# Altium schematic sheet chanel.SchDoc
size A4
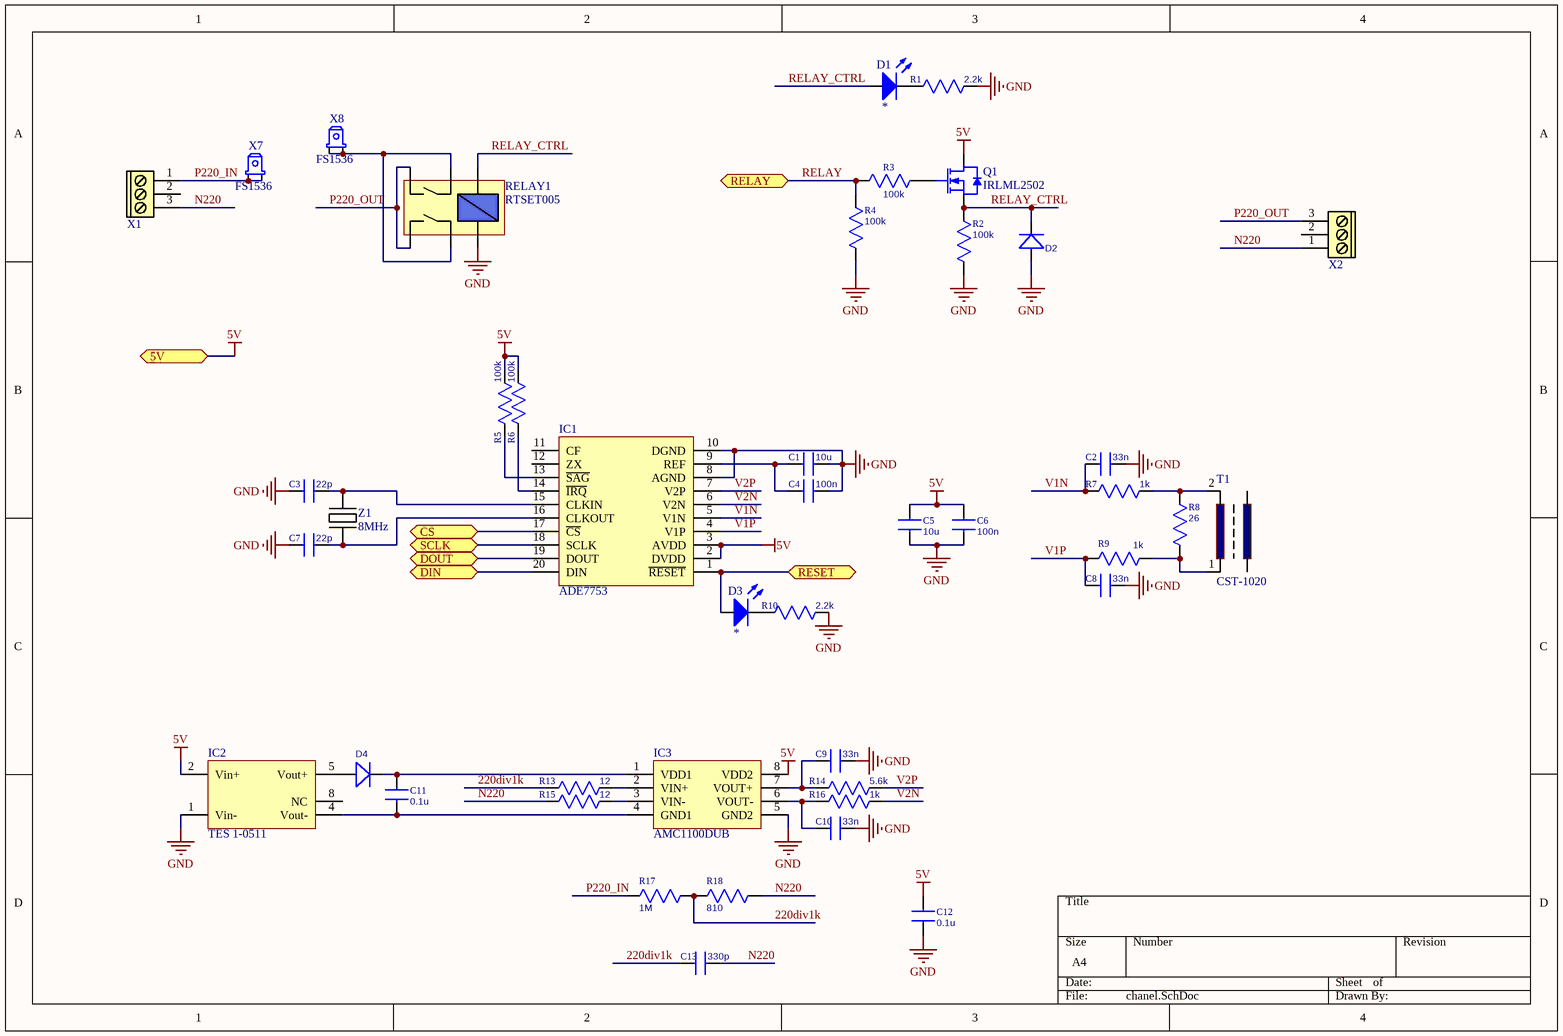
[diagram p0: chanel.SchDoc]

## Parts
C1  10u  [C_0805]
C2  33n  [C_0603]
C3  22p  [C_0603]
C4  100n  [C_0603]
C5  10u  [C_0805]
C6  100n  [C_0603]
C7  22p  [C_0603]
C8  33n  [C_0603]
C9  33n  [C_0603]
C10  33n  [C_0603]
C11  0.1u  [C_0603]
C12  0.1u  [C_0603]
C13  330p  [C_0603]
D1  *  [LED_5mm]
D2  D_DO-214AC  [DO-214AC]  (value not drawn)
D3  *  [LED_5mm]
D4  D_DO-214AC  [DO-214AC]  (value not drawn)
IC1  ADE7753  [SOP-20]
IC2  TES 1-0511  [TES 1-0511]
IC3  AMC1100DUB  [SOP254-8N]
Q1  IRLML2502  [SOT23]
R1  2.2k  [R_0603]
R2  100k  [R_0603]
R3  100k  [R_0603]
R4  100k  [R_0603]
R5  100k  [R_0603]
R6  100k  [R_0603]
R7  1k  [R_0603]
R8  26  [R_0805]
R9  1k  [R_0603]
R10  2.2k  [R_0603]
R13  12  [R_0603]
R14  5.6k  [R_0603]
R15  12  [R_0603]
R16  1k  [R_0603]
R17  1M  [R_0805]
R18  810  [R_0805]
RELAY1  RTSET005  [RTSET005]
T1  CST-1020  [CST-1020]
X1  DG-300-3  [DG-300-5MM-3]  (value not drawn)
X2  DG-300-3  [DG-300-5MM-3]  (value not drawn)
X7  FS1536  [FS1536]
X8  FS1536  [FS1536]
Z1  8MHz  [HC-49]

## Ports
5V, CS, DIN, DOUT, RELAY, RESET, SCLK

## Nets
5V: C5.2 C6.2 C12.2 IC1.2(DVDD) IC1.3(AVDD) IC2.2(Vin+) IC3.8(VDD2) Q1.3(D) R5.2 R6.2 ; port 5V
GND: C1.2 C2.2 C3.1 C4.2 C5.1 C6.1 C7.1 C8.2 C9.2 C10.2 C12.1 D2.1(A) IC1.8(AGND) IC1.10(DGND) IC2.1(Vin-) IC3.5(GND2) R1.2 R2.2 R4.2 R10.2 RELAY1.6
220div1k: C13.1 R13.1 R17.2 R18.1
CS: IC1.17(~{CS}) ; port CS
DIN: IC1.20(DIN) ; port DIN
DOUT: IC1.19(DOUT) ; port DOUT
N220: C13.2 R15.1 R18.2 X1.3 X2.1
P220_IN: R17.1 X1.1 X7.1
P220_OUT: RELAY1.1 RELAY1.2 X2.3
RELAY: R3.2 R4.1 ; port RELAY
RELAY_CTRL: D1.1(A) D2.2(K) Q1.2(S) R2.1 RELAY1.5
RESET: D3.1(A) IC1.1(~{RESET}) ; port RESET
SCLK: IC1.18(SCLK) ; port SCLK
V1N: C2.1 IC1.5(V1N) R7.1
V1P: C8.1 IC1.4(V1P) R9.1
V2N: IC1.6(V2N) R16.2
V2P: IC1.7(V2P) R14.2
NetC1_1: C1.1 C4.1 IC1.9(REF)
NetC3_2: C3.2 IC1.15(CLKIN) Z1.2
NetC7_2: C7.2 IC1.16(CLKOUT) Z1.1
NetC9_1: C9.1 IC3.7(VOUT+) R14.1
NetC10_1: C10.1 IC3.6(VOUT-) R16.1
NetC11_1: C11.1 IC2.4(Vout-) IC3.4(GND1)
NetC11_2: C11.2 D4.2(K) IC3.1(VDD1)
NetD1_2: D1.2(K) R1.1
NetD3_2: D3.2(K) R10.1
NetD4_1: D4.1(A) IC2.5(Vout+)
NetIC1_13: IC1.13(~{SAG}) R5.1
NetIC1_14: IC1.14(~{IRQ}) R6.1
NetIC3_2: IC3.2(VIN+) R13.2
NetIC3_3: IC3.3(VIN-) R15.2
NetQ1_1: Q1.1(G) R3.1
NetR7_2: R7.2 R8.1 T1.2
NetR8_2: R8.2 R9.2 T1.1
NetRELAY1_3: RELAY1.3 RELAY1.4 X8.1

Not connected (* = marked no-connect by the designer): IC1 11(CF) 12(ZX); IC2 8(NC); X1 2; X2 2

## Library data of the parts
C1 C5 = C0805: Capacitor; Value: 10u
C2-C4 C6-C13 = C0603: Capacitor
  C2 C8-C10: Value: 33n
  C3 C7: Value: 22p
  C4 C6: Value: 100n
  C11 C12: Value: 0.1u
  C13: Value: 330p
D1 D3 = LED_5mm: Typical INFRARED GaAs LED; Value: *; Color: *
D2 D4 = D_DO-214AC: Diode
IC1 = ADE7753ARSZ: Data Acquisition ADC/DAC
IC2 = TES 1-0511: Isolated DC/DC Converter
IC3 = AMC1100DUB: Isolation Amplifier 4.25kV PEAK Iso Amp
Q1 = N-ch_SOT23: N-Channel Enhancement Mode MOSFET; Published: 17-Dec-2003; DatasheetVersion: May-99; PackageVersion: 1996; PackageReference: SOT23; Publisher: Altium Limited; PackageDescription: SOT-23; 3 Leads; Body 3.1 x 2.5 mm, inc. leads (LxW max), Alternate Lead Configuration; ComponentLink1Description: Manufacturer Link; ComponentLink1URL: http://www.zetex.com/; ComponentLink2Description: Datasheet; ComponentLink2URL: www.zetex.com/3.0/pdf/ZXM61N02F.pdf
R1-R7 R9 R10 R13-R16 = R0603: Resistor
  R1 R10: Value: 2.2k
  R2-R6: Value: 100k
  R7 R9 R16: Value: 1k
  R13 R15: Value: 12
  R14: Value: 5.6k
R8 R17 R18 = R0805: Resistor
  R8: Value: 26
  R17: Value: 1M
  R18: Value: 810
RELAY1 = 1-1415898-8: General Purpose Relay
T1 = CST-1020: Current Transformer
X7 X8 = FS1536: PCB Soldering tips
Z1 = XTAL: Quartz resonator